# EAGLE design W975 (EAGLE 6.6.0)
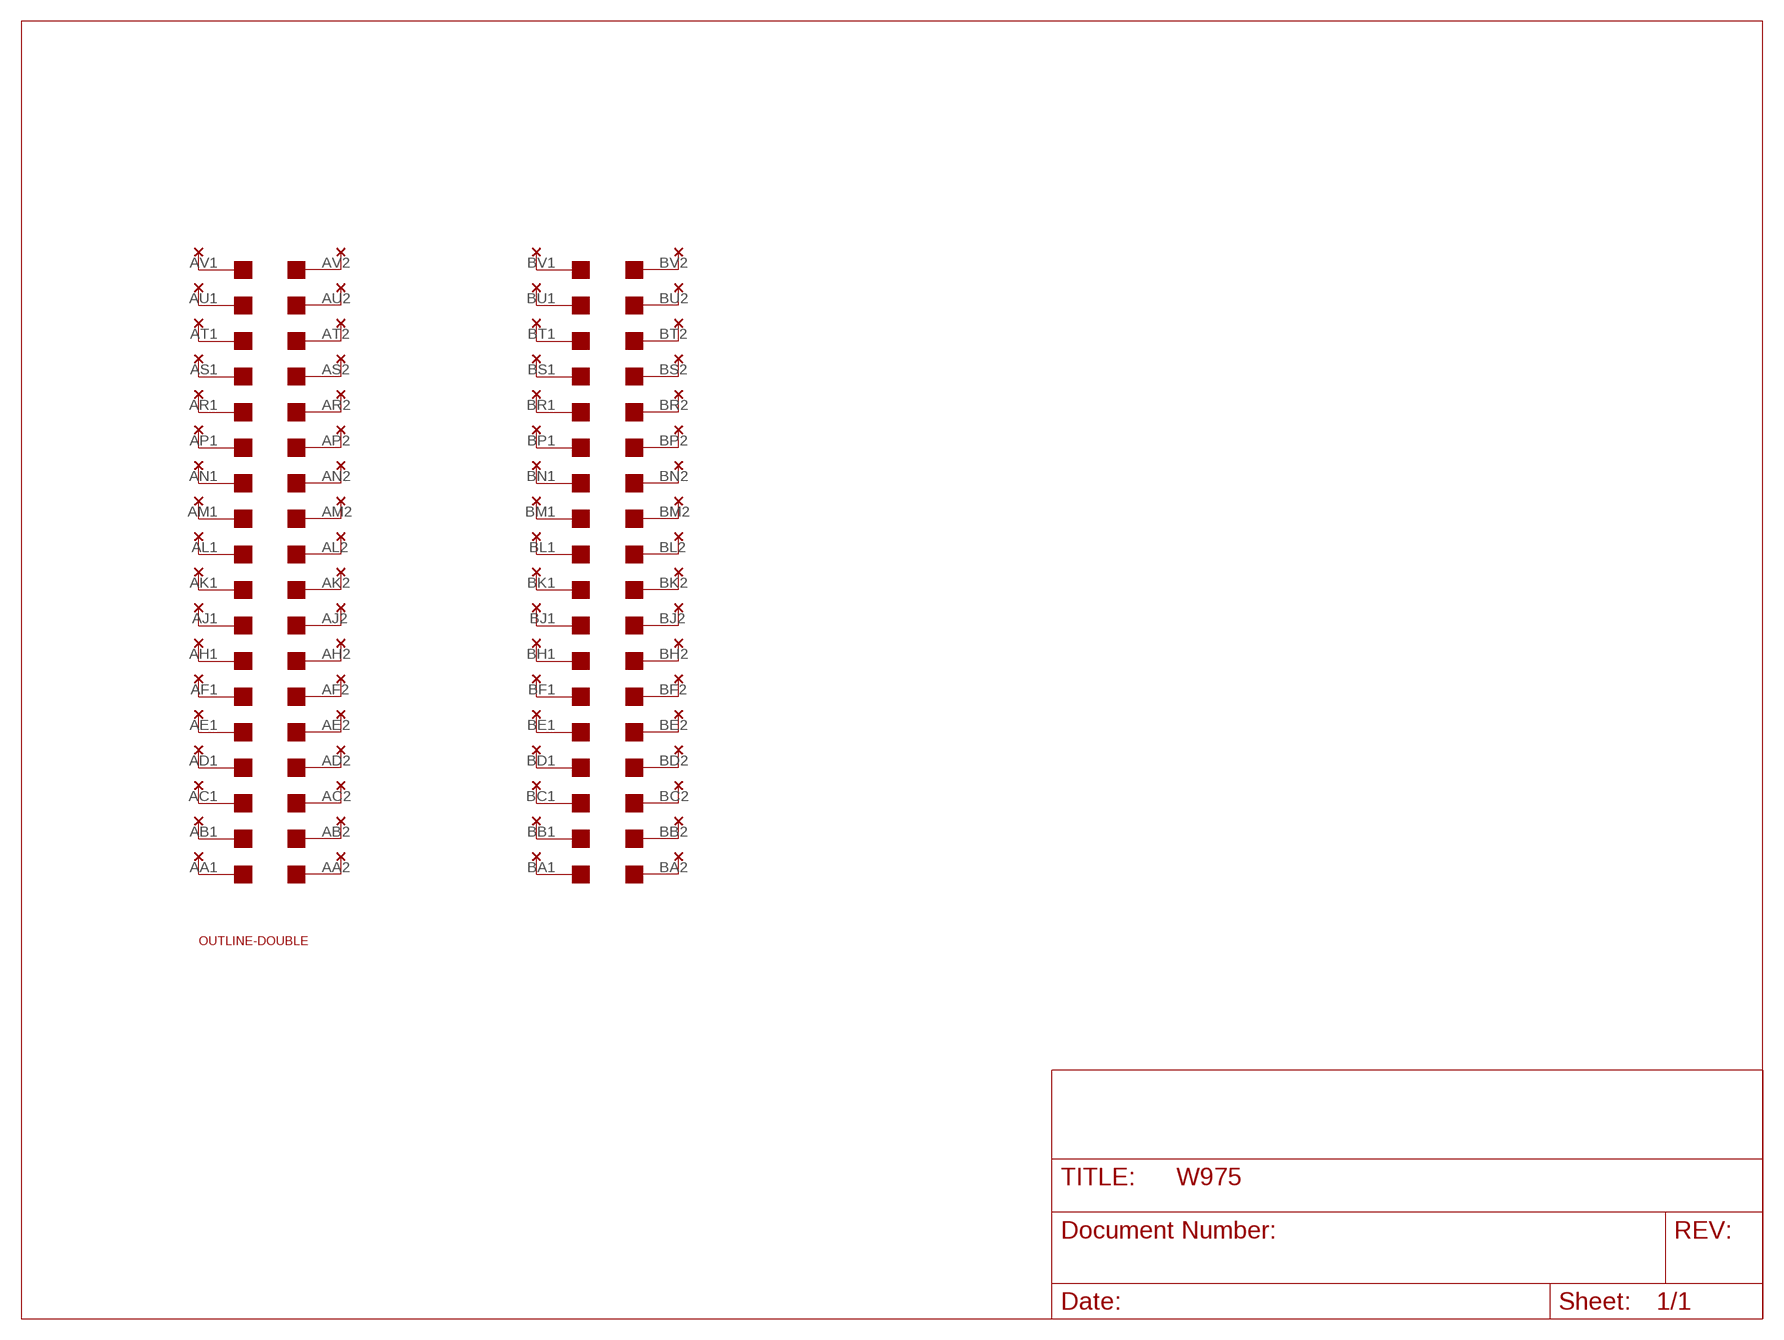
[diagram p0: schematic, sheet 1]

## Parts
A  A  THRU-HOLE2W  [THRU-HOLE2]
B  B  THRU-HOLE2W  [THRU-HOLE2]
U$1  OUTLINE-DOUBLE  [DOUBLE]
U$2  DOUBLE  [EDGE-CON4]

## Nets
N$1: A.K2 U$2.AK2
N$2: A.J2 U$2.AJ2
N$3: A.H2 U$2.AH2
N$4: A.L2 U$2.AL2
N$5: A.M2 U$2.AM2
N$6: A.N2 U$2.AN2
N$7: A.P2 U$2.AP2
N$8: A.F2 U$2.AF2
N$9: A.E2 U$2.AE2
N$10: A.D2 U$2.AD2
N$11: A.C2 U$2.AC2
N$12: A.R2 U$2.AR2
N$13: A.S2 U$2.AS2
N$14: A.B2 U$2.AB2
N$15: A.A2 U$2.AA2
N$16: A.T2 U$2.AT2
N$17: A.U2 U$2.AU2
N$18: A.V2 U$2.AV2
N$19: A.A1 U$2.AA1
N$20: A.V1 U$2.AV1
N$21: A.U1 U$2.AU1
N$22: A.T1 U$2.AT1
N$23: A.S1 U$2.AS1
N$24: A.R1 U$2.AR1
N$25: A.P1 U$2.AP1
N$26: A.N1 U$2.AN1
N$27: A.M1 U$2.AM1
N$28: A.L1 U$2.AL1
N$29: A.K1 U$2.AK1
N$30: A.J1 U$2.AJ1
N$31: A.H1 U$2.AH1
N$32: A.F1 U$2.AF1
N$33: A.E1 U$2.AE1
N$34: A.D1 U$2.AD1
N$35: A.C1 U$2.AC1
N$36: A.B1 U$2.AB1
N$37: B.K2 U$2.BK2
N$38: B.J2 U$2.BJ2
N$39: B.H2 U$2.BH2
N$40: B.L2 U$2.BL2
N$41: B.M2 U$2.BM2
N$42: B.N2 U$2.BN2
N$43: B.P2 U$2.BP2
N$44: B.F2 U$2.BF2
N$45: B.E2 U$2.BE2
N$46: B.D2 U$2.BD2
N$47: B.C2 U$2.BC2
N$48: B.R2 U$2.BR2
N$49: B.S2 U$2.BS2
N$50: B.B2 U$2.BB2
N$51: B.A2 U$2.BA2
N$52: B.T2 U$2.BT2
N$53: B.U2 U$2.BU2
N$54: B.V2 U$2.BV2
N$55: B.A1 U$2.BA1
N$56: B.V1 U$2.BV1
N$57: B.U1 U$2.BU1
N$58: B.T1 U$2.BT1
N$59: B.S1 U$2.BS1
N$60: B.R1 U$2.BR1
N$61: B.P1 U$2.BP1
N$62: B.N1 U$2.BN1
N$63: B.M1 U$2.BM1
N$64: B.L1 U$2.BL1
N$65: B.K1 U$2.BK1
N$66: B.J1 U$2.BJ1
N$67: B.H1 U$2.BH1
N$68: B.F1 U$2.BF1
N$69: B.E1 U$2.BE1
N$70: B.D1 U$2.BD1
N$71: B.C1 U$2.BC1
N$72: B.B1 U$2.BB1

## Library data of the parts
A B = dec-con:THRU-HOLE2: Thru-Hole addition to double-sided edge connector.
U$1 = dec-con:OUTLINE-*: Board outlines for DEC boards.
U$2 = dec-con:DOUBLE: Double-Height DEC board

## Net classes
0 default: width 0.508 mm, clearance 0.508 mm

## Board
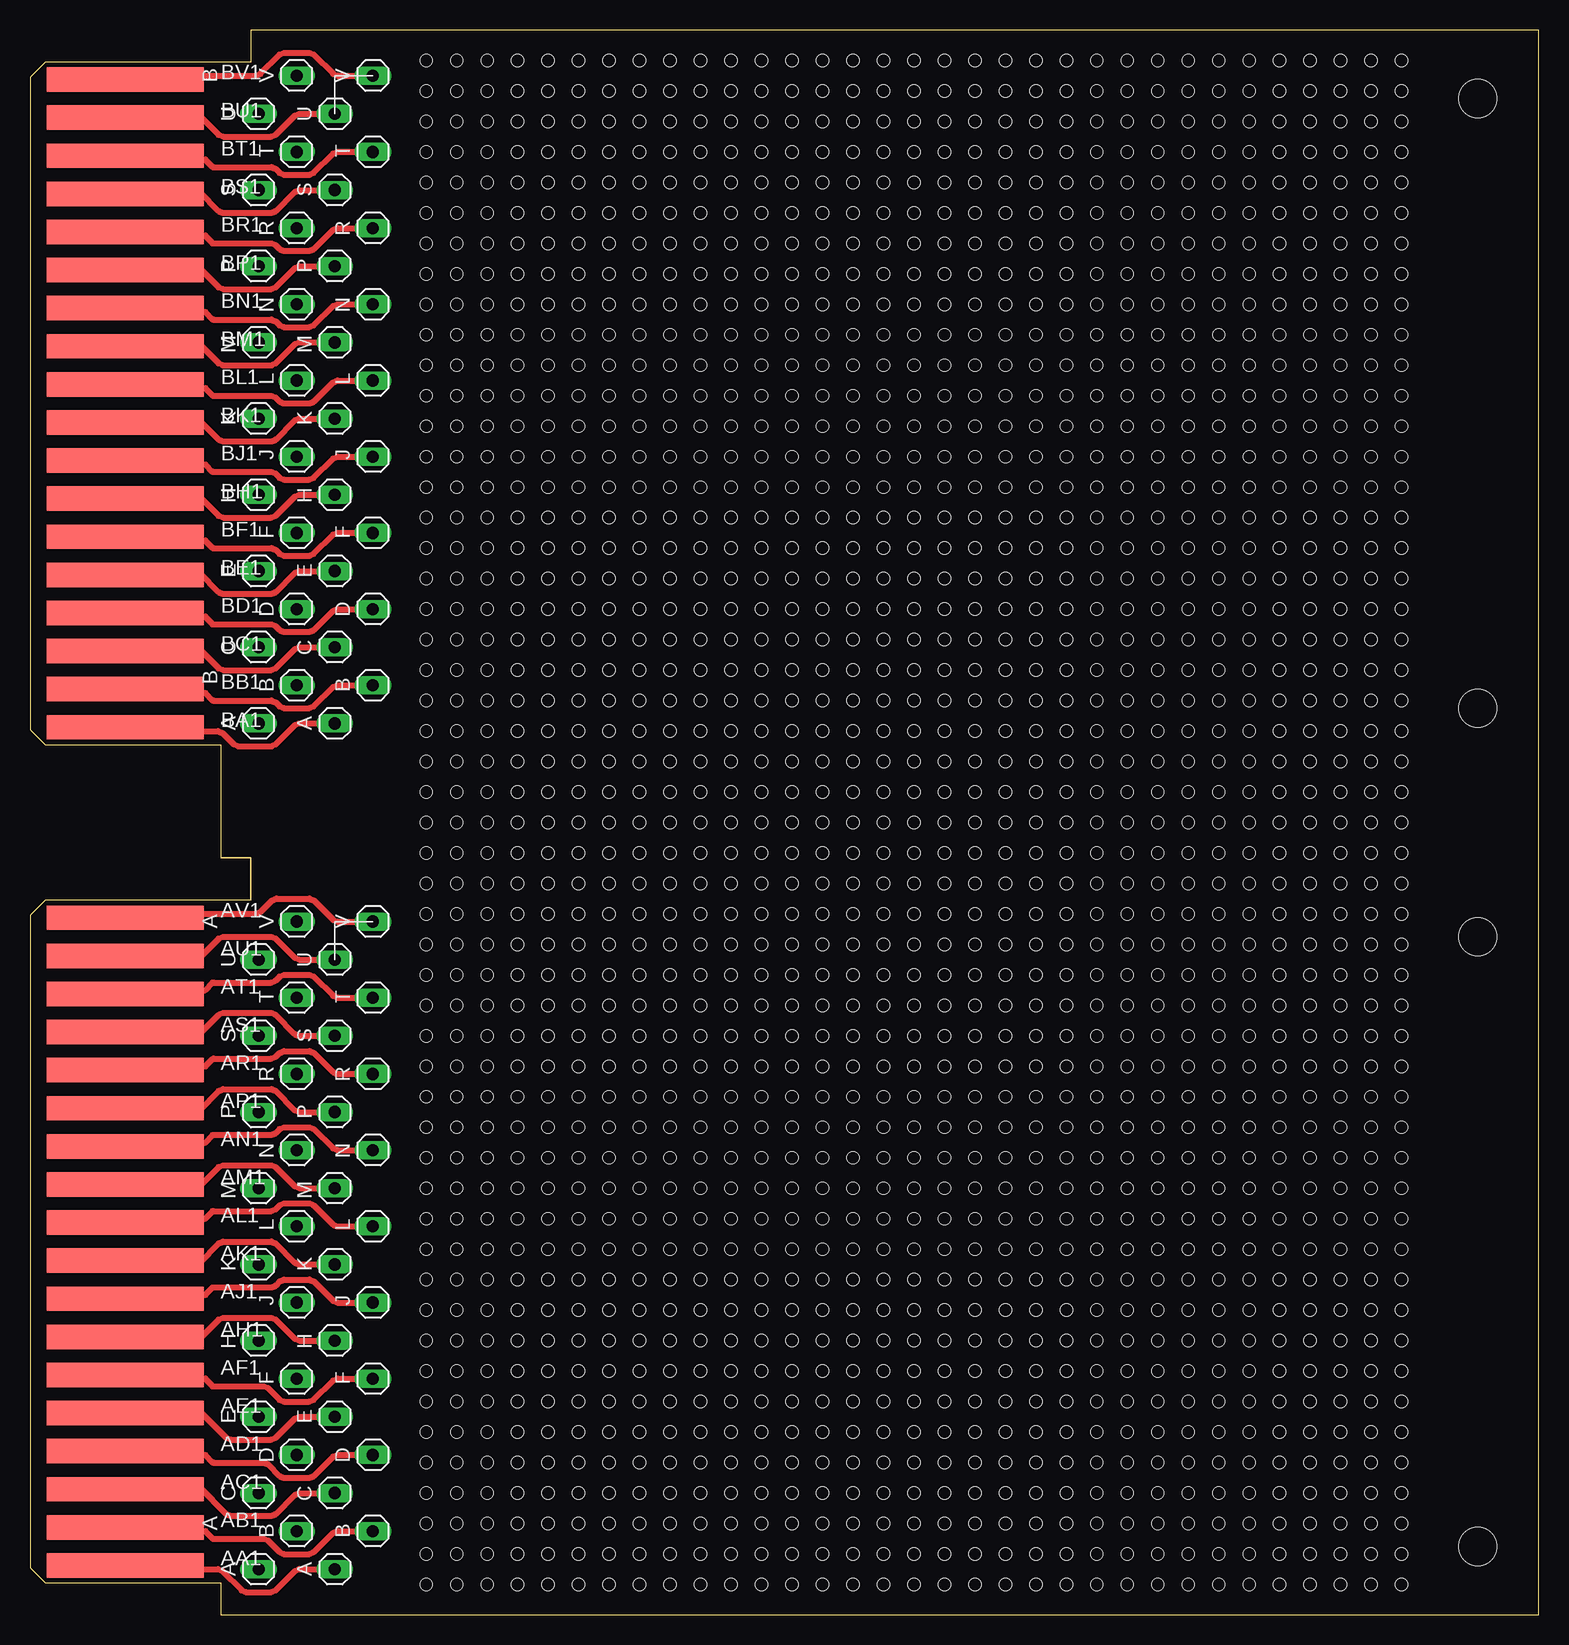
[diagram p1: board, top side]
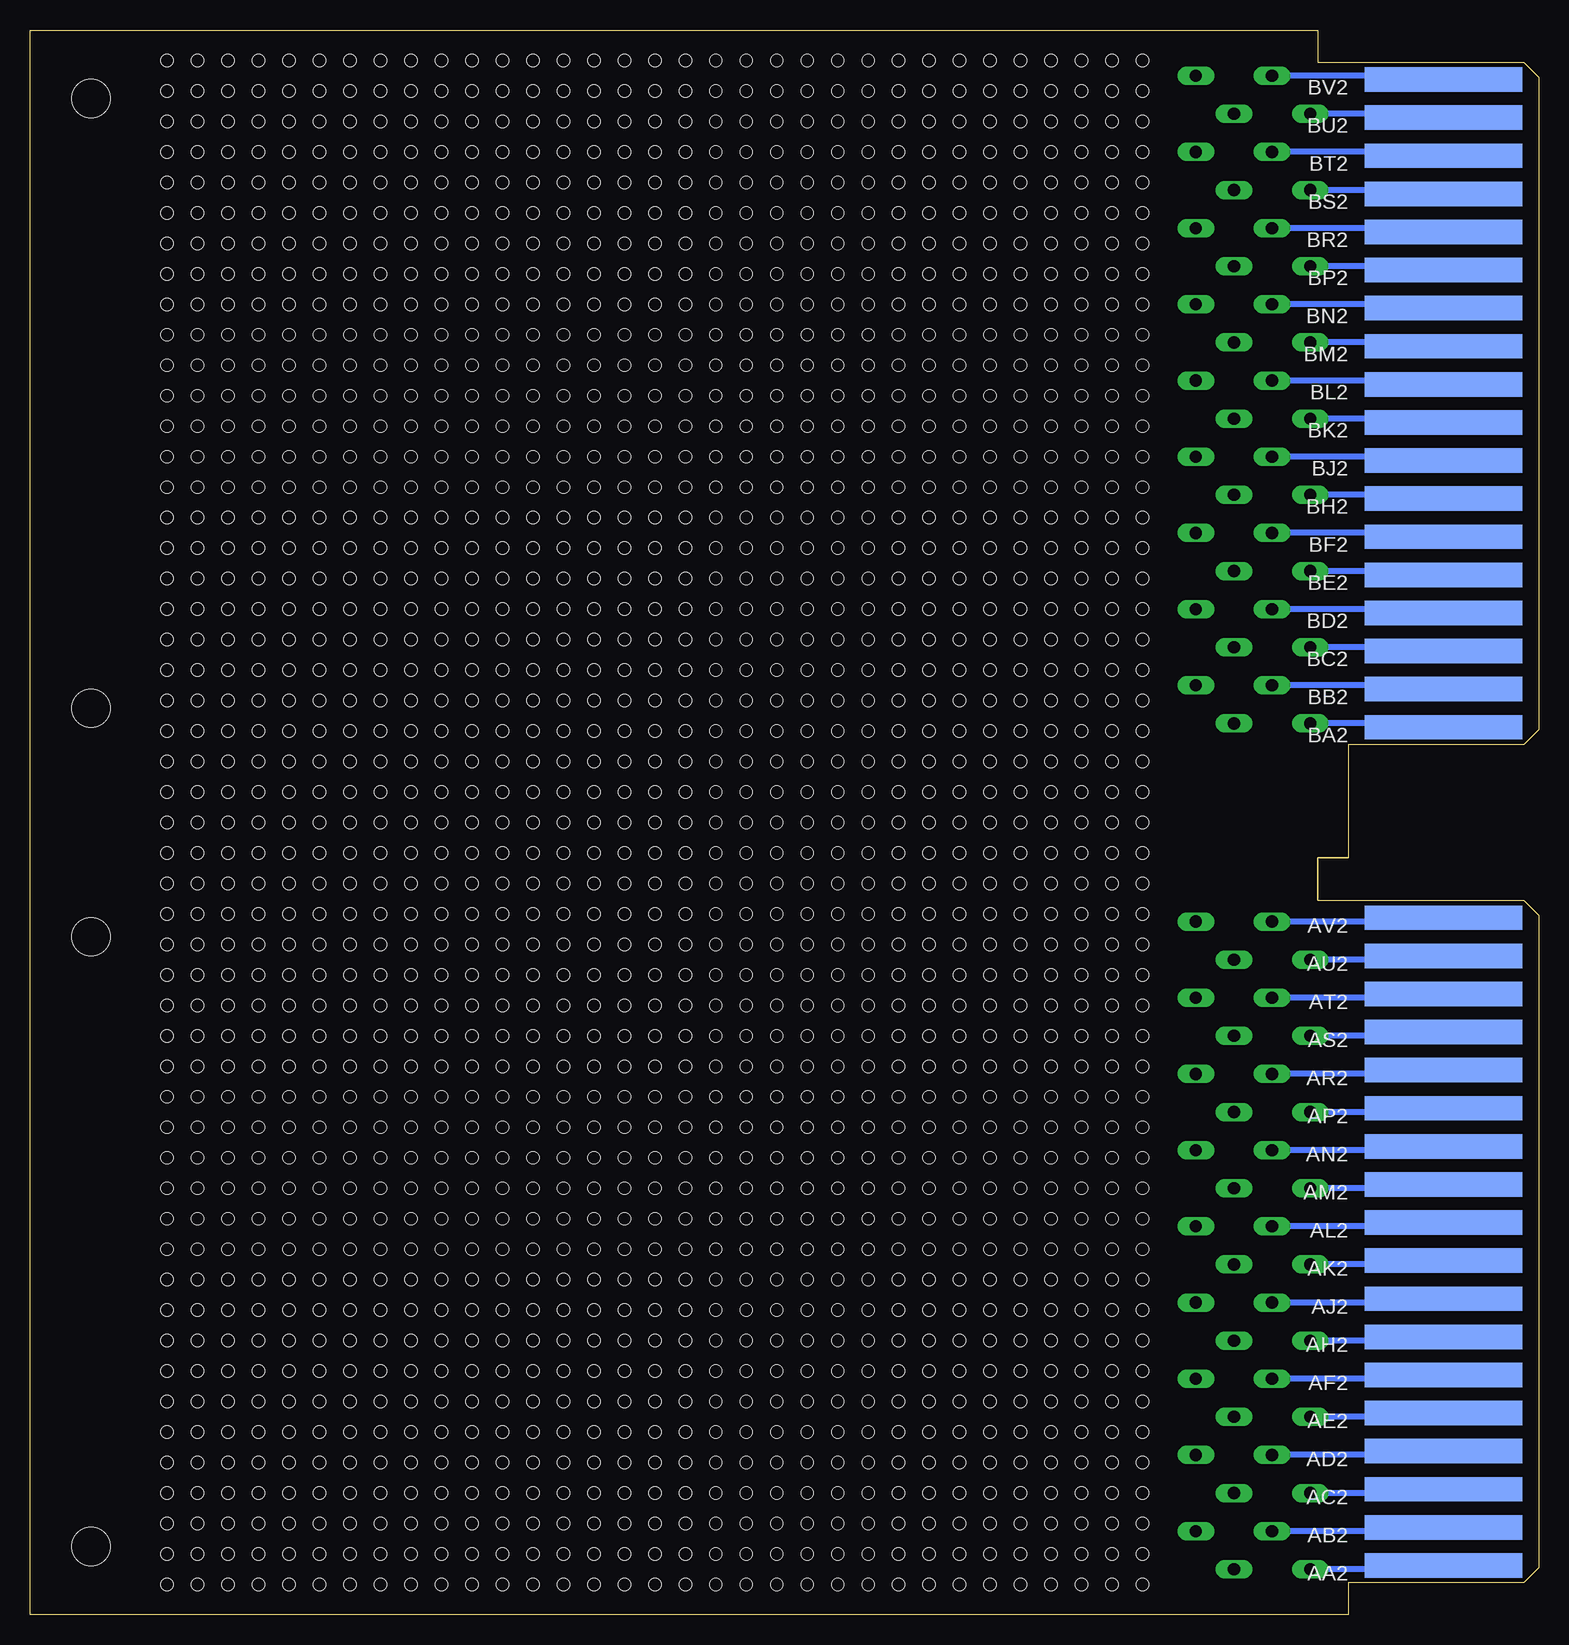
[diagram p2: board, bottom side, seen from below]

Size 125.73 x 132.08 mm. Coordinates in mm from the lower left corner, seen from the top.
Copper layers (1+16): Top 0.035mm / dielectric 1.5mm / Bottom 0.035mm
Design rules "16mils": minimum track width 16mil, minimum drill 32mil, track to track 15mil, track to pad 10mil, pad to pad 10mil, via to via 10mil, smd to smd 10mil, copper to edge 13mil, drill to drill 10mil, minimum pad ring 10mil, minimum via ring 8mil, stop-mask expansion 0mil, vias tented up to drill 0mil, thermal gap 10mil
Holes 1.02 mm at 33.02,129.54 33.02,127 35.56,127 35.56,129.54 33.02,124.46 35.56,124.46 38.1,124.46 38.1,127 38.1,129.54 40.64,129.54 40.64,127 43.18,127 43.18,129.54 40.64,124.46 43.18,124.46 45.72,124.46 45.72,127 45.72,129.54 33.02,121.92 33.02,119.38 35.56,119.38 35.56,121.92 33.02,116.84 35.56,116.84 38.1,116.84 38.1,119.38 38.1,121.92 40.64,121.92 40.64,119.38 43.18,119.38 43.18,121.92 40.64,116.84 43.18,116.84 45.72,116.84 45.72,119.38 45.72,121.92 48.26,129.54 48.26,127 50.8,127 50.8,129.54 48.26,124.46 50.8,124.46 53.34,124.46 53.34,127 53.34,129.54 55.88,129.54 55.88,127 58.42,127 58.42,129.54 55.88,124.46 58.42,124.46 60.96,124.46 60.96,127 60.96,129.54 48.26,121.92 48.26,119.38 50.8,119.38 50.8,121.92 48.26,116.84 50.8,116.84 53.34,116.84 53.34,119.38 53.34,121.92 55.88,121.92 55.88,119.38 58.42,119.38 58.42,121.92 55.88,116.84 58.42,116.84 60.96,116.84 60.96,119.38 60.96,121.92 63.5,129.54 63.5,127 66.04,127 66.04,129.54 63.5,124.46 66.04,124.46 68.58,124.46 68.58,127 68.58,129.54 71.12,129.54 71.12,127 73.66,127 73.66,129.54 71.12,124.46 73.66,124.46 76.2,124.46 76.2,127 76.2,129.54 63.5,121.92 63.5,119.38 66.04,119.38 66.04,121.92 63.5,116.84 66.04,116.84 68.58,116.84 68.58,119.38 68.58,121.92 71.12,121.92 71.12,119.38 73.66,119.38 73.66,121.92 71.12,116.84 73.66,116.84 76.2,116.84 76.2,119.38 76.2,121.92 78.74,129.54 78.74,127 81.28,127 81.28,129.54 78.74,124.46 81.28,124.46 83.82,124.46 83.82,127 83.82,129.54 86.36,129.54 86.36,127 88.9,127 88.9,129.54 86.36,124.46 88.9,124.46 91.44,124.46 91.44,127 91.44,129.54 78.74,121.92 78.74,119.38 81.28,119.38 81.28,121.92 78.74,116.84 81.28,116.84 83.82,116.84 83.82,119.38 83.82,121.92 86.36,121.92 86.36,119.38 88.9,119.38 88.9,121.92 86.36,116.84 88.9,116.84 91.44,116.84 91.44,119.38 91.44,121.92 93.98,129.54 93.98,127 96.52,127 96.52,129.54 93.98,124.46 96.52,124.46 99.06,124.46 99.06,127 99.06,129.54 101.6,129.54 101.6,127 104.14,127 104.14,129.54 101.6,124.46 104.14,124.46 106.68,124.46 106.68,127 106.68,129.54 93.98,121.92 93.98,119.38 96.52,119.38 96.52,121.92 93.98,116.84 96.52,116.84 99.06,116.84 99.06,119.38 99.06,121.92 101.6,121.92 101.6,119.38 104.14,119.38 104.14,121.92 101.6,116.84 104.14,116.84 106.68,116.84 106.68,119.38 106.68,121.92 109.22,124.46 109.22,127 109.22,129.54 111.76,129.54 111.76,127 114.3,127 114.3,129.54 111.76,124.46 114.3,124.46 109.22,116.84 109.22,119.38 109.22,121.92 111.76,121.92 111.76,119.38 114.3,119.38 114.3,121.92 111.76,116.84 114.3,116.84 33.02,114.3 33.02,111.76 35.56,111.76 35.56,114.3 33.02,109.22 35.56,109.22 38.1,109.22 38.1,111.76 38.1,114.3 40.64,114.3 40.64,111.76 43.18,111.76 43.18,114.3 40.64,109.22 43.18,109.22 45.72,109.22 45.72,111.76 45.72,114.3 33.02,106.68 33.02,104.14 35.56,104.14 35.56,106.68 33.02,101.6 35.56,101.6 38.1,101.6 38.1,104.14 38.1,106.68 40.64,106.68 40.64,104.14 43.18,104.14 43.18,106.68 40.64,101.6 43.18,101.6 45.72,101.6 45.72,104.14 45.72,106.68 48.26,114.3 48.26,111.76 50.8,111.76 50.8,114.3 48.26,109.22 50.8,109.22 53.34,109.22 53.34,111.76 53.34,114.3 55.88,114.3 55.88,111.76 58.42,111.76 58.42,114.3 55.88,109.22 58.42,109.22 60.96,109.22 60.96,111.76 60.96,114.3 48.26,106.68 48.26,104.14 50.8,104.14 50.8,106.68 48.26,101.6 50.8,101.6 53.34,101.6 53.34,104.14 53.34,106.68 55.88,106.68 55.88,104.14 58.42,104.14 58.42,106.68 55.88,101.6 58.42,101.6 60.96,101.6 60.96,104.14 60.96,106.68 63.5,114.3 63.5,111.76 66.04,111.76 66.04,114.3 63.5,109.22 66.04,109.22 68.58,109.22 68.58,111.76 68.58,114.3 71.12,114.3 71.12,111.76 73.66,111.76 73.66,114.3 71.12,109.22 73.66,109.22 76.2,109.22 76.2,111.76 76.2,114.3 63.5,106.68 63.5,104.14 66.04,104.14 66.04,106.68 63.5,101.6 66.04,101.6 68.58,101.6 68.58,104.14 68.58,106.68 71.12,106.68 71.12,104.14 73.66,104.14 73.66,106.68 71.12,101.6 73.66,101.6 76.2,101.6 76.2,104.14 76.2,106.68 78.74,114.3 78.74,111.76 81.28,111.76 81.28,114.3 78.74,109.22 81.28,109.22 83.82,109.22 83.82,111.76 83.82,114.3 86.36,114.3 86.36,111.76 88.9,111.76 88.9,114.3 86.36,109.22 88.9,109.22 91.44,109.22 91.44,111.76 91.44,114.3 78.74,106.68 78.74,104.14 81.28,104.14 81.28,106.68 78.74,101.6 81.28,101.6 83.82,101.6 83.82,104.14 83.82,106.68 86.36,106.68 86.36,104.14 88.9,104.14 88.9,106.68 86.36,101.6 88.9,101.6 91.44,101.6 91.44,104.14 91.44,106.68 93.98,114.3 93.98,111.76 96.52,111.76 96.52,114.3 93.98,109.22 96.52,109.22 99.06,109.22 99.06,111.76 99.06,114.3 101.6,114.3 101.6,111.76 104.14,111.76 104.14,114.3 101.6,109.22 104.14,109.22 106.68,109.22 106.68,111.76 106.68,114.3 93.98,106.68 93.98,104.14 96.52,104.14 96.52,106.68 93.98,101.6 96.52,101.6 99.06,101.6 99.06,104.14 99.06,106.68 101.6,106.68 101.6,104.14 104.14,104.14 104.14,106.68 101.6,101.6 104.14,101.6 106.68,101.6 106.68,104.14 106.68,106.68 109.22,109.22 109.22,111.76 109.22,114.3 111.76,114.3 111.76,111.76 114.3,111.76 114.3,114.3 111.76,109.22 114.3,109.22 109.22,101.6 109.22,104.14 109.22,106.68 111.76,106.68 111.76,104.14 114.3,104.14 114.3,106.68 111.76,101.6 114.3,101.6 33.02,99.06 33.02,96.52 35.56,96.52 35.56,99.06 33.02,93.98 35.56,93.98 38.1,93.98 38.1,96.52 38.1,99.06 40.64,99.06 40.64,96.52 43.18,96.52 43.18,99.06 40.64,93.98 43.18,93.98 45.72,93.98 45.72,96.52 45.72,99.06 33.02,91.44 33.02,88.9 35.56,88.9 35.56,91.44 33.02,86.36 35.56,86.36 38.1,86.36 38.1,88.9 38.1,91.44 40.64,91.44 40.64,88.9 43.18,88.9 43.18,91.44 40.64,86.36 43.18,86.36 45.72,86.36 45.72,88.9 45.72,91.44 48.26,99.06 48.26,96.52 50.8,96.52 50.8,99.06 48.26,93.98 50.8,93.98 53.34,93.98 53.34,96.52 53.34,99.06 55.88,99.06 55.88,96.52 58.42,96.52 58.42,99.06 55.88,93.98 58.42,93.98 60.96,93.98 60.96,96.52 60.96,99.06 48.26,91.44 48.26,88.9 50.8,88.9 50.8,91.44 48.26,86.36 50.8,86.36 53.34,86.36 53.34,88.9 53.34,91.44 55.88,91.44 55.88,88.9 58.42,88.9 58.42,91.44 55.88,86.36 58.42,86.36 60.96,86.36 60.96,88.9 60.96,91.44 63.5,99.06 63.5,96.52 66.04,96.52 66.04,99.06 63.5,93.98 66.04,93.98 68.58,93.98 68.58,96.52 68.58,99.06 71.12,99.06 71.12,96.52 73.66,96.52 73.66,99.06 71.12,93.98 73.66,93.98 76.2,93.98 76.2,96.52 76.2,99.06 63.5,91.44 63.5,88.9 66.04,88.9 66.04,91.44 63.5,86.36 66.04,86.36 68.58,86.36 68.58,88.9 68.58,91.44 71.12,91.44 71.12,88.9 73.66,88.9 73.66,91.44 71.12,86.36 73.66,86.36 76.2,86.36 76.2,88.9 76.2,91.44 78.74,99.06 78.74,96.52 81.28,96.52 81.28,99.06 78.74,93.98 81.28,93.98 83.82,93.98 83.82,96.52 83.82,99.06 86.36,99.06 86.36,96.52 88.9,96.52 88.9,99.06 86.36,93.98 88.9,93.98 91.44,93.98 91.44,96.52 91.44,99.06 78.74,91.44 78.74,88.9 81.28,88.9 81.28,91.44 78.74,86.36 81.28,86.36 83.82,86.36 83.82,88.9 83.82,91.44 86.36,91.44 86.36,88.9 88.9,88.9 88.9,91.44 86.36,86.36 88.9,86.36 91.44,86.36 91.44,88.9 91.44,91.44 93.98,99.06 93.98,96.52 96.52,96.52 96.52,99.06 93.98,93.98 96.52,93.98 99.06,93.98 99.06,96.52 99.06,99.06 101.6,99.06 101.6,96.52 104.14,96.52 104.14,99.06 101.6,93.98 104.14,93.98 106.68,93.98 106.68,96.52 106.68,99.06 93.98,91.44 93.98,88.9 96.52,88.9 96.52,91.44 93.98,86.36 96.52,86.36 99.06,86.36 99.06,88.9 99.06,91.44 101.6,91.44 101.6,88.9 104.14,88.9 104.14,91.44 101.6,86.36 104.14,86.36 106.68,86.36 106.68,88.9 106.68,91.44 109.22,93.98 109.22,96.52 109.22,99.06 111.76,99.06 111.76,96.52 114.3,96.52 114.3,99.06 111.76,93.98 114.3,93.98 109.22,86.36 109.22,88.9 109.22,91.44 111.76,91.44 111.76,88.9 114.3,88.9 114.3,91.44 111.76,86.36 114.3,86.36 33.02,83.82 33.02,81.28 35.56,81.28 35.56,83.82 33.02,78.74 35.56,78.74 38.1,78.74 38.1,81.28 38.1,83.82 40.64,83.82 40.64,81.28 43.18,81.28 43.18,83.82 40.64,78.74 43.18,78.74 45.72,78.74 45.72,81.28 45.72,83.82 33.02,76.2 33.02,73.66 35.56,73.66 35.56,76.2 33.02,71.12 35.56,71.12 38.1,71.12 38.1,73.66 38.1,76.2 40.64,76.2 40.64,73.66 43.18,73.66 43.18,76.2 40.64,71.12 43.18,71.12 45.72,71.12 45.72,73.66 45.72,76.2 48.26,83.82 48.26,81.28 50.8,81.28 50.8,83.82 48.26,78.74 50.8,78.74 53.34,78.74 53.34,81.28 53.34,83.82 55.88,83.82 55.88,81.28 58.42,81.28 58.42,83.82 55.88,78.74 58.42,78.74 60.96,78.74 60.96,81.28 60.96,83.82 48.26,76.2 48.26,73.66 50.8,73.66 50.8,76.2 48.26,71.12 50.8,71.12 53.34,71.12 53.34,73.66 53.34,76.2 55.88,76.2 55.88,73.66 58.42,73.66 58.42,76.2 55.88,71.12 58.42,71.12 60.96,71.12 60.96,73.66 60.96,76.2 63.5,83.82 63.5,81.28 66.04,81.28 66.04,83.82 63.5,78.74 66.04,78.74 68.58,78.74 68.58,81.28 68.58,83.82 71.12,83.82 71.12,81.28 73.66,81.28 73.66,83.82 71.12,78.74 73.66,78.74 76.2,78.74 76.2,81.28 76.2,83.82 63.5,76.2 63.5,73.66 66.04,73.66 66.04,76.2 63.5,71.12 66.04,71.12 68.58,71.12 68.58,73.66 68.58,76.2 71.12,76.2 71.12,73.66 73.66,73.66 73.66,76.2 71.12,71.12 73.66,71.12 76.2,71.12 76.2,73.66 76.2,76.2 78.74,83.82 78.74,81.28 81.28,81.28 81.28,83.82 78.74,78.74 81.28,78.74 83.82,78.74 83.82,81.28 83.82,83.82 86.36,83.82 86.36,81.28 88.9,81.28 88.9,83.82 86.36,78.74 88.9,78.74 91.44,78.74 91.44,81.28 91.44,83.82 78.74,76.2 78.74,73.66 81.28,73.66 81.28,76.2 78.74,71.12 81.28,71.12 83.82,71.12 83.82,73.66 83.82,76.2 86.36,76.2 86.36,73.66 88.9,73.66 88.9,76.2 86.36,71.12 88.9,71.12 91.44,71.12 91.44,73.66 91.44,76.2 93.98,83.82 93.98,81.28 96.52,81.28 96.52,83.82 93.98,78.74 96.52,78.74 99.06,78.74 99.06,81.28 99.06,83.82 101.6,83.82 101.6,81.28 104.14,81.28 104.14,83.82 101.6,78.74 104.14,78.74 106.68,78.74 106.68,81.28 106.68,83.82 93.98,76.2 93.98,73.66 96.52,73.66 96.52,76.2 93.98,71.12 96.52,71.12 99.06,71.12 99.06,73.66 99.06,76.2 101.6,76.2 101.6,73.66 104.14,73.66 104.14,76.2 101.6,71.12 104.14,71.12 106.68,71.12 106.68,73.66 106.68,76.2 109.22,78.74 109.22,81.28 109.22,83.82 111.76,83.82 111.76,81.28 114.3,81.28 114.3,83.82 111.76,78.74 114.3,78.74 109.22,71.12 109.22,73.66 109.22,76.2 111.76,76.2 111.76,73.66 114.3,73.66 114.3,76.2 111.76,71.12 114.3,71.12 33.02,68.58 33.02,66.04 35.56,66.04 35.56,68.58 33.02,63.5 35.56,63.5 38.1,63.5 38.1,66.04 38.1,68.58 40.64,68.58 40.64,66.04 43.18,66.04 43.18,68.58 40.64,63.5 43.18,63.5 45.72,63.5 45.72,66.04 45.72,68.58 33.02,60.96 33.02,58.42 35.56,58.42 35.56,60.96 33.02,55.88 35.56,55.88 38.1,55.88 38.1,58.42 38.1,60.96 40.64,60.96 40.64,58.42 43.18,58.42 43.18,60.96 40.64,55.88 43.18,55.88 45.72,55.88 45.72,58.42 45.72,60.96 48.26,68.58 48.26,66.04 50.8,66.04 50.8,68.58 48.26,63.5 50.8,63.5 53.34,63.5 53.34,66.04 53.34,68.58 55.88,68.58 55.88,66.04 58.42,66.04 58.42,68.58 55.88,63.5 58.42,63.5 60.96,63.5 60.96,66.04 60.96,68.58 48.26,60.96 48.26,58.42 50.8,58.42 50.8,60.96 48.26,55.88 50.8,55.88 53.34,55.88 53.34,58.42 53.34,60.96 55.88,60.96 55.88,58.42 58.42,58.42 58.42,60.96 55.88,55.88 58.42,55.88 60.96,55.88 60.96,58.42 60.96,60.96 63.5,68.58 63.5,66.04 66.04,66.04 66.04,68.58 63.5,63.5 66.04,63.5 68.58,63.5 68.58,66.04 68.58,68.58 71.12,68.58 71.12,66.04 73.66,66.04 73.66,68.58 71.12,63.5 73.66,63.5 76.2,63.5 76.2,66.04 76.2,68.58 63.5,60.96 63.5,58.42 66.04,58.42 66.04,60.96 63.5,55.88 66.04,55.88 68.58,55.88 68.58,58.42 68.58,60.96 71.12,60.96 71.12,58.42 73.66,58.42 73.66,60.96 71.12,55.88 73.66,55.88 76.2,55.88 76.2,58.42 76.2,60.96 78.74,68.58 78.74,66.04 81.28,66.04 81.28,68.58 78.74,63.5 81.28,63.5 83.82,63.5 83.82,66.04 83.82,68.58 86.36,68.58 86.36,66.04 88.9,66.04 88.9,68.58 86.36,63.5 88.9,63.5 91.44,63.5 91.44,66.04 91.44,68.58 78.74,60.96 78.74,58.42 81.28,58.42 81.28,60.96 78.74,55.88 81.28,55.88 83.82,55.88 83.82,58.42 83.82,60.96 86.36,60.96 86.36,58.42 88.9,58.42 88.9,60.96 86.36,55.88 88.9,55.88 91.44,55.88 91.44,58.42 91.44,60.96 93.98,68.58 93.98,66.04 96.52,66.04 96.52,68.58 93.98,63.5 96.52,63.5 99.06,63.5 99.06,66.04 99.06,68.58 101.6,68.58 101.6,66.04 104.14,66.04 104.14,68.58 101.6,63.5 104.14,63.5 106.68,63.5 106.68,66.04 106.68,68.58 93.98,60.96 93.98,58.42 96.52,58.42 96.52,60.96 93.98,55.88 96.52,55.88 99.06,55.88 99.06,58.42 99.06,60.96 101.6,60.96 101.6,58.42 104.14,58.42 104.14,60.96 101.6,55.88 104.14,55.88 106.68,55.88 106.68,58.42 106.68,60.96 109.22,63.5 109.22,66.04 109.22,68.58 111.76,68.58 111.76,66.04 114.3,66.04 114.3,68.58 111.76,63.5 114.3,63.5 109.22,55.88 109.22,58.42 109.22,60.96 111.76,60.96 111.76,58.42 114.3,58.42 114.3,60.96 111.76,55.88 114.3,55.88 33.02,53.34 33.02,50.8 35.56,50.8 35.56,53.34 33.02,48.26 35.56,48.26 38.1,48.26 38.1,50.8 38.1,53.34 40.64,53.34 40.64,50.8 43.18,50.8 43.18,53.34 40.64,48.26 43.18,48.26 45.72,48.26 45.72,50.8 45.72,53.34 33.02,45.72 33.02,43.18 35.56,43.18 35.56,45.72 33.02,40.64 35.56,40.64 38.1,40.64 38.1,43.18 38.1,45.72 40.64,45.72 40.64,43.18 43.18,43.18 43.18,45.72 40.64,40.64 43.18,40.64 45.72,40.64 45.72,43.18 45.72,45.72 48.26,53.34 48.26,50.8 50.8,50.8 50.8,53.34 48.26,48.26 50.8,48.26 53.34,48.26 53.34,50.8 53.34,53.34 55.88,53.34 55.88,50.8 58.42,50.8 58.42,53.34 55.88,48.26 58.42,48.26 60.96,48.26 60.96,50.8 60.96,53.34 48.26,45.72 48.26,43.18 50.8,43.18 50.8,45.72 48.26,40.64 50.8,40.64 53.34,40.64 53.34,43.18 53.34,45.72 55.88,45.72 55.88,43.18 58.42,43.18 58.42,45.72 55.88,40.64 58.42,40.64 60.96,40.64 60.96,43.18 60.96,45.72 63.5,53.34 63.5,50.8 66.04,50.8 66.04,53.34 63.5,48.26 66.04,48.26 68.58,48.26 68.58,50.8 68.58,53.34 71.12,53.34 71.12,50.8 73.66,50.8 73.66,53.34 71.12,48.26 73.66,48.26 76.2,48.26 76.2,50.8 76.2,53.34 63.5,45.72 63.5,43.18 66.04,43.18 66.04,45.72 63.5,40.64 66.04,40.64 68.58,40.64 68.58,43.18 68.58,45.72 71.12,45.72 71.12,43.18 73.66,43.18 73.66,45.72 71.12,40.64 73.66,40.64 76.2,40.64 76.2,43.18 76.2,45.72 78.74,53.34 78.74,50.8 81.28,50.8 81.28,53.34 78.74,48.26 81.28,48.26 83.82,48.26 83.82,50.8 83.82,53.34 86.36,53.34 86.36,50.8 88.9,50.8 88.9,53.34 86.36,48.26 88.9,48.26 91.44,48.26 91.44,50.8 91.44,53.34 78.74,45.72 78.74,43.18 81.28,43.18 81.28,45.72 78.74,40.64 81.28,40.64 83.82,40.64 83.82,43.18 83.82,45.72 86.36,45.72 86.36,43.18 88.9,43.18 88.9,45.72 86.36,40.64 88.9,40.64 91.44,40.64 91.44,43.18 91.44,45.72 93.98,53.34 93.98,50.8 96.52,50.8 96.52,53.34 93.98,48.26 96.52,48.26 99.06,48.26 99.06,50.8 99.06,53.34 101.6,53.34 101.6,50.8 104.14,50.8 104.14,53.34 101.6,48.26 104.14,48.26 106.68,48.26 106.68,50.8 106.68,53.34 93.98,45.72 93.98,43.18 96.52,43.18 96.52,45.72 93.98,40.64 96.52,40.64 99.06,40.64 99.06,43.18 99.06,45.72 101.6,45.72 101.6,43.18 104.14,43.18 104.14,45.72 101.6,40.64 104.14,40.64 106.68,40.64 106.68,43.18 106.68,45.72 109.22,48.26 109.22,50.8 109.22,53.34 111.76,53.34 111.76,50.8 114.3,50.8 114.3,53.34 111.76,48.26 114.3,48.26 109.22,40.64 109.22,43.18 109.22,45.72 111.76,45.72 111.76,43.18 114.3,43.18 114.3,45.72 111.76,40.64 114.3,40.64 33.02,38.1 33.02,35.56 35.56,35.56 35.56,38.1 33.02,33.02 35.56,33.02 38.1,33.02 38.1,35.56 38.1,38.1 40.64,38.1 40.64,35.56 43.18,35.56 43.18,38.1 40.64,33.02 43.18,33.02 45.72,33.02 45.72,35.56 45.72,38.1 33.02,30.48 33.02,27.94 35.56,27.94 35.56,30.48 33.02,25.4 35.56,25.4 38.1,25.4 38.1,27.94 38.1,30.48 40.64,30.48 40.64,27.94 43.18,27.94 43.18,30.48 40.64,25.4 43.18,25.4 45.72,25.4 45.72,27.94 45.72,30.48 48.26,38.1 48.26,35.56 50.8,35.56 50.8,38.1 48.26,33.02 50.8,33.02 53.34,33.02 53.34,35.56 53.34,38.1 55.88,38.1 55.88,35.56 58.42,35.56 58.42,38.1 55.88,33.02 58.42,33.02 60.96,33.02 60.96,35.56 60.96,38.1 48.26,30.48 48.26,27.94 50.8,27.94 50.8,30.48 48.26,25.4 50.8,25.4 53.34,25.4 53.34,27.94 53.34,30.48 55.88,30.48 55.88,27.94 58.42,27.94 58.42,30.48 55.88,25.4 58.42,25.4 60.96,25.4 60.96,27.94 60.96,30.48 63.5,38.1 63.5,35.56 66.04,35.56 66.04,38.1 63.5,33.02 66.04,33.02 68.58,33.02 68.58,35.56 68.58,38.1 71.12,38.1 71.12,35.56 73.66,35.56 73.66,38.1 71.12,33.02 73.66,33.02 76.2,33.02 76.2,35.56 76.2,38.1 63.5,30.48 63.5,27.94 66.04,27.94 66.04,30.48 63.5,25.4 66.04,25.4 68.58,25.4 68.58,27.94 68.58,30.48 71.12,30.48 71.12,27.94 73.66,27.94 73.66,30.48 71.12,25.4 73.66,25.4 76.2,25.4 76.2,27.94 76.2,30.48 78.74,38.1 78.74,35.56 81.28,35.56 81.28,38.1 78.74,33.02 81.28,33.02 83.82,33.02 83.82,35.56 83.82,38.1 86.36,38.1 86.36,35.56 88.9,35.56 88.9,38.1 86.36,33.02 88.9,33.02 91.44,33.02 91.44,35.56 91.44,38.1 78.74,30.48 78.74,27.94 81.28,27.94 81.28,30.48 78.74,25.4 81.28,25.4 83.82,25.4 83.82,27.94 83.82,30.48 86.36,30.48 86.36,27.94 88.9,27.94 88.9,30.48 86.36,25.4 88.9,25.4 91.44,25.4 91.44,27.94 91.44,30.48 93.98,38.1 93.98,35.56 96.52,35.56 96.52,38.1 93.98,33.02 96.52,33.02 99.06,33.02 99.06,35.56 99.06,38.1 101.6,38.1 101.6,35.56 104.14,35.56 104.14,38.1 101.6,33.02 104.14,33.02 106.68,33.02 106.68,35.56 106.68,38.1 93.98,30.48 93.98,27.94 96.52,27.94 96.52,30.48 93.98,25.4 96.52,25.4 99.06,25.4 99.06,27.94 99.06,30.48 101.6,30.48 101.6,27.94 104.14,27.94 104.14,30.48 101.6,25.4 104.14,25.4 106.68,25.4 106.68,27.94 106.68,30.48 109.22,33.02 109.22,35.56 109.22,38.1 111.76,38.1 111.76,35.56 114.3,35.56 114.3,38.1 111.76,33.02 114.3,33.02 109.22,25.4 109.22,27.94 109.22,30.48 111.76,30.48 111.76,27.94 114.3,27.94 114.3,30.48 111.76,25.4 114.3,25.4 33.02,22.86 33.02,20.32 35.56,20.32 35.56,22.86 33.02,17.78 35.56,17.78 38.1,17.78 38.1,20.32 38.1,22.86 40.64,22.86 40.64,20.32 43.18,20.32 43.18,22.86 40.64,17.78 43.18,17.78 45.72,17.78 45.72,20.32 45.72,22.86 33.02,15.24 33.02,12.7 35.56,12.7 35.56,15.24 33.02,10.16 35.56,10.16 38.1,10.16 38.1,12.7 38.1,15.24 40.64,15.24 40.64,12.7 43.18,12.7 43.18,15.24 40.64,10.16 43.18,10.16 45.72,10.16 45.72,12.7 45.72,15.24 48.26,22.86 48.26,20.32 50.8,20.32 50.8,22.86 48.26,17.78 50.8,17.78 53.34,17.78 53.34,20.32 53.34,22.86 55.88,22.86 55.88,20.32 58.42,20.32 58.42,22.86 55.88,17.78 58.42,17.78 60.96,17.78 60.96,20.32 60.96,22.86 48.26,15.24 48.26,12.7 50.8,12.7 50.8,15.24 48.26,10.16 50.8,10.16 53.34,10.16 53.34,12.7 53.34,15.24 55.88,15.24 55.88,12.7 58.42,12.7 58.42,15.24 55.88,10.16 58.42,10.16 60.96,10.16 60.96,12.7 60.96,15.24 63.5,22.86 63.5,20.32 66.04,20.32 66.04,22.86 63.5,17.78 66.04,17.78 68.58,17.78 68.58,20.32 68.58,22.86 71.12,22.86 71.12,20.32 73.66,20.32 73.66,22.86 71.12,17.78 73.66,17.78 76.2,17.78 76.2,20.32 76.2,22.86 63.5,15.24 63.5,12.7 66.04,12.7 66.04,15.24 63.5,10.16 66.04,10.16 68.58,10.16 68.58,12.7 68.58,15.24 71.12,15.24 71.12,12.7 73.66,12.7 73.66,15.24 71.12,10.16 73.66,10.16 76.2,10.16 76.2,12.7 76.2,15.24 78.74,22.86 78.74,20.32 81.28,20.32 81.28,22.86 78.74,17.78 81.28,17.78 83.82,17.78 83.82,20.32 83.82,22.86 86.36,22.86 86.36,20.32 88.9,20.32 88.9,22.86 86.36,17.78 88.9,17.78 91.44,17.78 91.44,20.32 91.44,22.86 78.74,15.24 78.74,12.7 81.28,12.7 81.28,15.24 78.74,10.16 81.28,10.16 83.82,10.16 83.82,12.7 83.82,15.24 86.36,15.24 86.36,12.7 88.9,12.7 88.9,15.24 86.36,10.16 88.9,10.16 91.44,10.16 91.44,12.7 91.44,15.24 93.98,22.86 93.98,20.32 96.52,20.32 96.52,22.86 93.98,17.78 96.52,17.78 99.06,17.78 99.06,20.32 99.06,22.86 101.6,22.86 101.6,20.32 104.14,20.32 104.14,22.86 101.6,17.78 104.14,17.78 106.68,17.78 106.68,20.32 106.68,22.86 93.98,15.24 93.98,12.7 96.52,12.7 96.52,15.24 93.98,10.16 96.52,10.16 99.06,10.16 99.06,12.7 99.06,15.24 101.6,15.24 101.6,12.7 104.14,12.7 104.14,15.24 101.6,10.16 104.14,10.16 106.68,10.16 106.68,12.7 106.68,15.24 109.22,17.78 109.22,20.32 109.22,22.86 111.76,22.86 111.76,20.32 114.3,20.32 114.3,22.86 111.76,17.78 114.3,17.78 109.22,10.16 109.22,12.7 109.22,15.24 111.76,15.24 111.76,12.7 114.3,12.7 114.3,15.24 111.76,10.16 114.3,10.16 33.02,7.62 33.02,5.08 35.56,5.08 35.56,7.62 33.02,2.54 35.56,2.54 38.1,2.54 38.1,5.08 38.1,7.62 40.64,7.62 40.64,5.08 43.18,5.08 43.18,7.62 40.64,2.54 43.18,2.54 45.72,2.54 45.72,5.08 45.72,7.62 48.26,7.62 48.26,5.08 50.8,5.08 50.8,7.62 48.26,2.54 50.8,2.54 53.34,2.54 53.34,5.08 53.34,7.62 55.88,7.62 55.88,5.08 58.42,5.08 58.42,7.62 55.88,2.54 58.42,2.54 60.96,2.54 60.96,5.08 60.96,7.62 63.5,7.62 63.5,5.08 66.04,5.08 66.04,7.62 63.5,2.54 66.04,2.54 68.58,2.54 68.58,5.08 68.58,7.62 71.12,7.62 71.12,5.08 73.66,5.08 73.66,7.62 71.12,2.54 73.66,2.54 76.2,2.54 76.2,5.08 76.2,7.62 78.74,7.62 78.74,5.08 81.28,5.08 81.28,7.62 78.74,2.54 81.28,2.54 83.82,2.54 83.82,5.08 83.82,7.62 86.36,7.62 86.36,5.08 88.9,5.08 88.9,7.62 86.36,2.54 88.9,2.54 91.44,2.54 91.44,5.08 91.44,7.62 93.98,7.62 93.98,5.08 96.52,5.08 96.52,7.62 93.98,2.54 96.52,2.54 99.06,2.54 99.06,5.08 99.06,7.62 101.6,7.62 101.6,5.08 104.14,5.08 104.14,7.62 101.6,2.54 104.14,2.54 106.68,2.54 106.68,5.08 106.68,7.62 109.22,2.54 109.22,5.08 109.22,7.62 111.76,7.62 111.76,5.08 114.3,5.08 114.3,7.62 111.76,2.54 114.3,2.54

### Footprints (pad centres in the part's own frame; a part is rotated, then mirrored left to right if it is on the bottom)
THRU-HOLE2 = drill 1.016 long: A1 28.575,9.525; A2 28.575,3.175; B1 25.4,12.7; B2 25.4,6.35; C1 22.225,9.525; C2 22.225,3.175; D1 19.05,12.7; D2 19.05,6.35; E1 15.875,9.525; E2 15.875,3.175; F1 12.7,12.7; F2 12.7,6.35; H1 9.525,9.525; H2 9.525,3.175; J1 6.35,12.7; J2 6.35,6.35; K1 3.175,9.525; K2 3.175,3.175; L1 0,12.7; L2 0,6.35; M1 -3.175,9.525; M2 -3.175,3.175; N1 -6.35,12.7; N2 -6.35,6.35; P1 -9.525,9.525; P2 -9.525,3.175; R1 -12.7,12.7; R2 -12.7,6.35; S1 -15.875,9.525; S2 -15.875,3.175; T1 -19.05,12.7; T2 -19.05,6.35; U1 -22.225,9.525; U2 -22.225,3.175; V1 -25.4,12.7; V2 -25.4,6.35
DOUBLE = hole 3.175: 120.65,56.515; 120.65,5.715; 120.65,75.565; 120.65,126.365
EDGE-CON4 = smd 13.106 x 2.032: AA1 7.938,4.128; AB1 7.938,7.303; AC1 7.938,10.477; AD1 7.938,13.652; AE1 7.938,16.828; AF1 7.938,20.003; AH1 7.938,23.177; AJ1 7.938,26.352; AK1 7.938,29.527; AL1 7.938,32.703; AM1 7.938,35.877; AN1 7.938,39.053; AP1 7.938,42.227; AR1 7.938,45.403; AS1 7.938,48.578; AT1 7.938,51.752; AU1 7.938,54.928; AV1 7.938,58.102; BA1 7.938,73.978; BB1 7.938,77.153; BC1 7.938,80.328; BD1 7.938,83.502; BE1 7.938,86.677; BF1 7.938,89.853; BH1 7.938,93.028; BJ1 7.938,96.203; BK1 7.938,99.377; BL1 7.938,102.552; BM1 7.938,105.728; BN1 7.938,108.903; BP1 7.938,112.078; BR1 7.938,115.252; BS1 7.938,118.427; BT1 7.938,121.603; BU1 7.938,124.778; BV1 7.938,127.953 | smd 13.106 x 2.032 bottom: AA2 7.938,4.128; AB2 7.938,7.303; AC2 7.938,10.477; AD2 7.938,13.652; AE2 7.938,16.828; AF2 7.938,20.003; AH2 7.938,23.177; AJ2 7.938,26.352; AK2 7.938,29.527; AL2 7.938,32.703; AM2 7.938,35.877; AN2 7.938,39.053; AP2 7.938,42.227; AR2 7.938,45.403; AS2 7.938,48.578; AT2 7.938,51.752; AU2 7.938,54.928; AV2 7.938,58.102; BA2 7.938,73.978; BB2 7.938,77.153; BC2 7.938,80.328; BD2 7.938,83.502; BE2 7.938,86.677; BF2 7.938,89.853; BH2 7.938,93.028; BJ2 7.938,96.203; BK2 7.938,99.377; BL2 7.938,102.552; BM2 7.938,105.728; BN2 7.938,108.903; BP2 7.938,112.078; BR2 7.938,115.252; BS2 7.938,118.427; BT2 7.938,121.603; BU2 7.938,124.778; BV2 7.938,127.953

### Placement (x,y rotation side)
A  15.88,32.38 270 top
B  15.88,102.87 270 top
U$1  0,0 0 top
U$2  0,0 0 top

### Tracks (layer width: path | path; a pad name or v marks a point on that pad's centre or on a via)
N$1
  Bottom 0.508: A.K2 17.78,29.21 13.98,29.21 13.96,29.21 U$2.AK2
N$2
  Bottom 0.508: A.J2 20.96,26.04 13.98,26.04 13.96,26.04 U$2.AJ2
N$3
  Bottom 0.508: A.H2 17.78,22.86 13.98,22.86 13.96,22.86 U$2.AH2
N$4
  Bottom 0.508: A.L2 20.96,32.38 13.98,32.38 13.96,32.39 U$2.AL2
N$5
  Bottom 0.508: A.M2 17.78,35.56 13.98,35.56 13.96,35.56 U$2.AM2
N$6
  Bottom 0.508: A.N2 20.96,38.73 13.98,38.73 13.96,38.74 U$2.AN2
N$7
  Bottom 0.508: A.P2 17.78,41.91 13.98,41.91 13.96,41.91 U$2.AP2
N$8
  Bottom 0.508: A.F2 20.96,19.68 13.98,19.68 13.96,19.69 U$2.AF2
N$9
  Bottom 0.508: A.E2 17.78,16.51 13.98,16.51 13.96,16.51 U$2.AE2
N$10
  Bottom 0.508: A.D2 20.96,13.34 13.98,13.34 13.96,13.34 U$2.AD2
N$11
  Bottom 0.508: A.C2 17.78,10.16 13.98,10.16 13.96,10.16 U$2.AC2
N$12
  Bottom 0.508: A.R2 20.96,45.09 13.98,45.09 13.96,45.09 U$2.AR2
N$13
  Bottom 0.508: A.S2 17.78,48.26 13.98,48.26 13.96,48.26 U$2.AS2
N$14
  Bottom 0.508: A.B2 20.96,6.99 13.99,6.99 13.96,6.99 U$2.AB2
N$15
  Bottom 0.508: A.A2 17.78,3.81 13.99,3.81 13.95,3.81 U$2.AA2
N$16
  Bottom 0.508: A.T2 20.96,51.44 13.98,51.44 13.96,51.44 U$2.AT2
N$17
  Bottom 0.508: A.U2 17.78,54.61 13.98,54.61 13.96,54.61 U$2.AU2
N$18
  Bottom 0.508: A.V2 20.96,57.78 13.98,57.78 13.96,57.78 U$2.AV2
N$19
  Top 0.508: A.A1 24.13,3.81 22.44,3.81 22.08,3.66 20.47,2.05 20.11,1.91 17.99,1.91 17.63,2.05 16.02,3.66 15.67,3.81 13.99,3.81 13.95,3.81 U$2.AA1
N$20
  Top 0.508: A.V1 27.31,57.78 25.61,57.78 25.25,57.93 23.64,59.54 23.29,59.69 20.53,59.69 20.17,59.54 19.2,58.57 18.84,58.42 13.99,58.42 13.96,58.42 U$2.AV1
N$21
  Top 0.508: A.U1 24.13,54.61 22.44,54.61 22.08,54.76 20.47,56.37 20.11,56.52 16.09,56.52 15.73,56.37 14.13,54.77 13.74,54.62 U$2.AU1
N$22
  Top 0.508: A.T1 25.61,51.44 25.25,51.58 23.64,53.19 23.29,53.34 21.17,53.34 20.81,53.19 20.47,52.85 20.11,52.7 15.28,52.7 15.2,52.7 15.2,52.67 14.61,52.07 U$2.AT1
N$23
  Top 0.508: A.S1 24.13,48.26 22.44,48.26 22.08,48.41 20.47,50.02 20.11,50.16 16.09,50.16 15.73,50.02 14.13,48.42 13.75,48.27 U$2.AS1
N$24
  Top 0.508: A.R1 25.61,45.09 25.25,45.23 23.64,46.84 23.29,46.99 21.17,46.99 20.81,46.84 20.47,46.5 20.11,46.35 15.28,46.35 15.2,46.35 15.2,46.32 14.61,45.72 U$2.AR1
N$25
  Top 0.508: A.P1 24.13,41.91 22.44,41.91 22.08,42.06 20.47,43.67 20.11,43.81 16.09,43.81 15.73,43.67 14.13,42.07 13.74,41.92 U$2.AP1
N$26
  Top 0.508: A.N1 25.61,38.73 25.25,38.88 23.64,40.49 23.29,40.64 21.17,40.64 20.81,40.49 20.47,40.15 20.11,40.01 15.28,40.01 15.2,40 15.2,39.97 14.61,39.37 U$2.AN1
N$27
  Top 0.508: A.M1 24.13,35.56 22.44,35.56 22.08,35.71 20.47,37.32 20.11,37.47 16.09,37.47 15.73,37.32 14.13,35.72 13.74,35.57 U$2.AM1
N$28
  Top 0.508: A.L1 25.61,32.38 25.25,32.53 23.64,34.14 23.29,34.29 21.17,34.29 20.81,34.14 20.47,33.8 20.11,33.66 15.28,33.66 15.2,33.65 15.2,33.62 14.61,33.02 U$2.AL1
N$29
  Top 0.508: A.K1 24.13,29.21 22.44,29.21 22.08,29.36 20.47,30.97 20.11,31.11 16.09,31.11 15.73,30.97 14.13,29.37 13.75,29.22 U$2.AK1
N$30
  Top 0.508: A.J1 25.61,26.04 25.25,26.18 23.64,27.79 23.29,27.94 21.17,27.94 20.81,27.79 20.47,27.45 20.11,27.3 15.28,27.3 15.2,27.3 15.2,27.27 14.61,26.67 U$2.AJ1
N$31
  Top 0.508: A.H1 24.13,22.86 22.44,22.86 22.08,23.01 20.47,24.62 20.11,24.77 16.09,24.77 15.73,24.62 14.13,23.02 13.74,22.87 U$2.AH1
N$32
  Top 0.508: A.F1 25.61,19.68 25.25,19.54 23.64,17.93 23.29,17.78 21.17,17.78 20.81,17.93 19.83,18.9 19.48,19.05 15.28,19.05 15.2,19.06 15.2,19.09 14.61,19.68 U$2.AF1
N$33
  Top 0.508: A.E1 24.13,16.51 22.44,16.51 22.08,16.36 20.47,14.75 20.11,14.61 16.72,14.61 16.36,14.75 14.13,16.99 13.75,17.13 U$2.AE1
N$34
  Top 0.508: A.D1 25.61,13.34 25.25,13.19 23.64,11.58 23.29,11.43 21.17,11.43 20.81,11.58 19.83,12.55 19.48,12.7 15.28,12.7 15.2,12.71 15.2,12.74 14.61,13.34 U$2.AD1
N$35
  Top 0.508: A.C1 24.13,10.16 22.44,10.16 22.08,10.01 20.47,8.4 20.11,8.26 16.72,8.26 16.36,8.4 14.13,10.63 13.75,10.78 U$2.AC1
N$36
  Top 0.508: A.B1 25.61,6.99 25.25,6.84 23.64,5.23 23.29,5.08 21.17,5.08 20.81,5.23 19.83,6.2 19.48,6.35 15.28,6.35 15.2,6.36 15.2,6.39 14.61,6.99 U$2.AB1
N$37
  Bottom 0.508: B.K2 17.78,99.69 13.98,99.69 13.96,99.69 U$2.BK2
N$38
  Bottom 0.508: B.J2 20.96,96.52 13.98,96.52 13.96,96.52 U$2.BJ2
N$39
  Bottom 0.508: B.H2 17.78,93.34 13.98,93.34 13.96,93.34 U$2.BH2
N$40
  Bottom 0.508: B.L2 20.96,102.87 13.98,102.87 13.96,102.87 U$2.BL2
N$41
  Bottom 0.508: B.M2 17.78,106.05 13.98,106.05 13.96,106.04 U$2.BM2
N$42
  Bottom 0.508: B.N2 20.96,109.22 13.98,109.22 13.96,109.22 U$2.BN2
N$43
  Bottom 0.508: B.P2 17.78,112.39 13.98,112.39 13.96,112.39 U$2.BP2
N$44
  Bottom 0.508: B.F2 20.96,90.17 13.98,90.17 13.96,90.17 U$2.BF2
N$45
  Bottom 0.508: B.E2 17.78,87 13.98,87 13.96,86.99 U$2.BE2
N$46
  Bottom 0.508: B.D2 20.96,83.82 13.98,83.82 13.96,83.82 U$2.BD2
N$47
  Bottom 0.508: B.C2 17.78,80.64 13.98,80.64 13.96,80.64 U$2.BC2
N$48
  Bottom 0.508: B.R2 20.96,115.57 13.98,115.57 13.96,115.57 U$2.BR2
N$49
  Bottom 0.508: B.S2 17.78,118.75 13.98,118.75 13.96,118.74 U$2.BS2
N$50
  Bottom 0.508: B.B2 20.96,77.47 13.98,77.47 13.96,77.47 U$2.BB2
N$51
  Bottom 0.508: B.A2 17.78,74.3 13.98,74.3 13.96,74.3 U$2.BA2
N$52
  Bottom 0.508: B.T2 20.96,121.92 13.98,121.92 13.96,121.92 U$2.BT2
N$53
  Bottom 0.508: B.U2 17.78,125.09 13.98,125.09 13.96,125.09 U$2.BU2
N$54
  Bottom 0.508: B.V2 20.96,128.27 13.99,128.27 13.96,128.27 U$2.BV2
N$55
  Top 0.508: B.A1 24.13,74.3 22.44,74.3 22.08,74.15 20.47,72.54 20.11,72.39 17.36,72.39 17,72.54 16.02,73.51 15.67,73.66 13.99,73.66 13.95,73.66 U$2.BA1
N$56
  Top 0.508: B.V1 27.31,128.27 25.61,128.27 25.25,128.42 23.64,130.03 23.29,130.18 21.17,130.18 20.81,130.03 19.2,128.42 18.84,128.27 13.99,128.27 13.96,128.27 U$2.BV1
N$57
  Top 0.508: B.U1 24.13,125.09 22.44,125.09 22.08,124.95 20.47,123.34 20.11,123.19 16.09,123.19 15.73,123.34 14.13,124.94 13.75,125.08 U$2.BU1
N$58
  Top 0.508: B.T1 25.61,121.92 25.25,121.77 23.64,120.16 23.29,120.02 21.17,120.02 20.81,120.16 20.47,120.5 20.11,120.65 15.28,120.65 15.2,120.66 15.2,120.69 14.61,121.28 U$2.BT1
N$59
  Top 0.508: B.S1 24.13,118.75 22.44,118.75 22.08,118.6 20.47,116.99 20.11,116.84 16.09,116.84 15.73,116.99 14.13,118.58 13.74,118.73 U$2.BS1
N$60
  Top 0.508: B.R1 25.61,115.57 25.25,115.42 23.64,113.81 23.29,113.67 21.17,113.67 20.81,113.81 20.47,114.15 20.11,114.3 15.28,114.3 15.2,114.31 15.2,114.34 14.61,114.94 U$2.BR1
N$61
  Top 0.508: B.P1 24.13,112.39 22.44,112.39 22.08,112.25 20.47,110.64 20.11,110.49 16.09,110.49 15.73,110.64 14.13,112.24 13.75,112.38 U$2.BP1
N$62
  Top 0.508: B.N1 25.61,109.22 25.25,109.07 23.64,107.46 23.29,107.31 21.17,107.31 20.81,107.46 20.47,107.8 20.11,107.95 15.28,107.95 15.2,107.96 15.2,107.99 14.61,108.58 U$2.BN1
N$63
  Top 0.508: B.M1 24.13,106.05 22.44,106.05 22.08,105.9 20.47,104.29 20.11,104.14 16.09,104.14 15.73,104.29 14.13,105.89 13.75,106.03 U$2.BM1
N$64
  Top 0.508: B.L1 25.61,102.87 25.25,102.72 23.64,101.11 23.29,100.97 21.17,100.97 20.81,101.11 20.47,101.45 20.11,101.6 15.28,101.6 15.2,101.61 15.2,101.64 14.61,102.23 U$2.BL1
N$65
  Top 0.508: B.K1 24.13,99.69 22.44,99.69 22.08,99.55 20.47,97.94 20.11,97.79 16.09,97.79 15.73,97.94 14.13,99.53 13.74,99.68 U$2.BK1
N$66
  Top 0.508: B.J1 25.61,96.52 25.25,96.37 23.64,94.76 23.29,94.61 21.17,94.61 20.81,94.76 20.47,95.1 20.11,95.25 15.28,95.25 15.2,95.26 15.2,95.29 14.61,95.89 U$2.BJ1
N$67
  Top 0.508: B.H1 24.13,93.34 22.44,93.34 22.08,93.2 20.47,91.59 20.11,91.44 16.09,91.44 15.73,91.59 14.13,93.19 13.75,93.33 U$2.BH1
N$68
  Top 0.508: B.F1 25.61,90.17 25.25,90.02 23.64,88.41 23.29,88.27 21.17,88.27 20.81,88.41 20.47,88.75 20.11,88.9 15.28,88.9 15.2,88.91 15.2,88.94 14.61,89.53 U$2.BF1
N$69
  Top 0.508: B.E1 24.13,87 22.44,87 22.08,86.85 20.47,85.24 20.11,85.09 16.09,85.09 15.73,85.24 14.13,86.84 13.75,86.98 U$2.BE1
N$70
  Top 0.508: B.D1 25.61,83.82 25.25,83.67 23.64,82.06 23.29,81.92 21.17,81.92 20.81,82.06 20.47,82.4 20.11,82.55 15.28,82.55 15.2,82.56 15.2,82.59 14.61,83.19 U$2.BD1
N$71
  Top 0.508: B.C1 24.13,80.64 22.44,80.64 22.08,80.5 20.47,78.89 20.11,78.74 16.09,78.74 15.73,78.89 14.13,80.48 13.75,80.63 U$2.BC1
N$72
  Top 0.508: B.B1 25.61,77.47 25.25,77.32 23.64,75.71 23.29,75.56 21.17,75.56 20.81,75.71 20.47,76.05 20.11,76.2 15.28,76.2 15.2,76.21 15.2,76.24 14.61,76.83 U$2.BB1